# Altium schematic sheet SAML21_Xplained_Pro_TopLevel.SchDoc: Top Level Schematics
size A3; Organization: ATMEL Norway; Address1: Vestre Rosten 79; Address2: N-7075 TILLER; Address3: NORWAY; DocumentNumber: A09-2241; Revision: 4; SheetNumber: 1; SheetTotal: 10; PageSetup: Record=PageOptions|CenterHorizontal=True|CenterVertical=True|PrintScale=1.01|XCorrection=1.00|YCorrection=1.00|PrintKind=1|BorderSize=5000000|LeftOffset=0|BottomOffset=0|Orientation=2|PaperLength=1000|PaperWidth=1000|Scale=100|PaperSource=7|PrintQuality=-4|MediaType=1|DitherType=10|PaperKind=Letter|PrintScaleMode=1
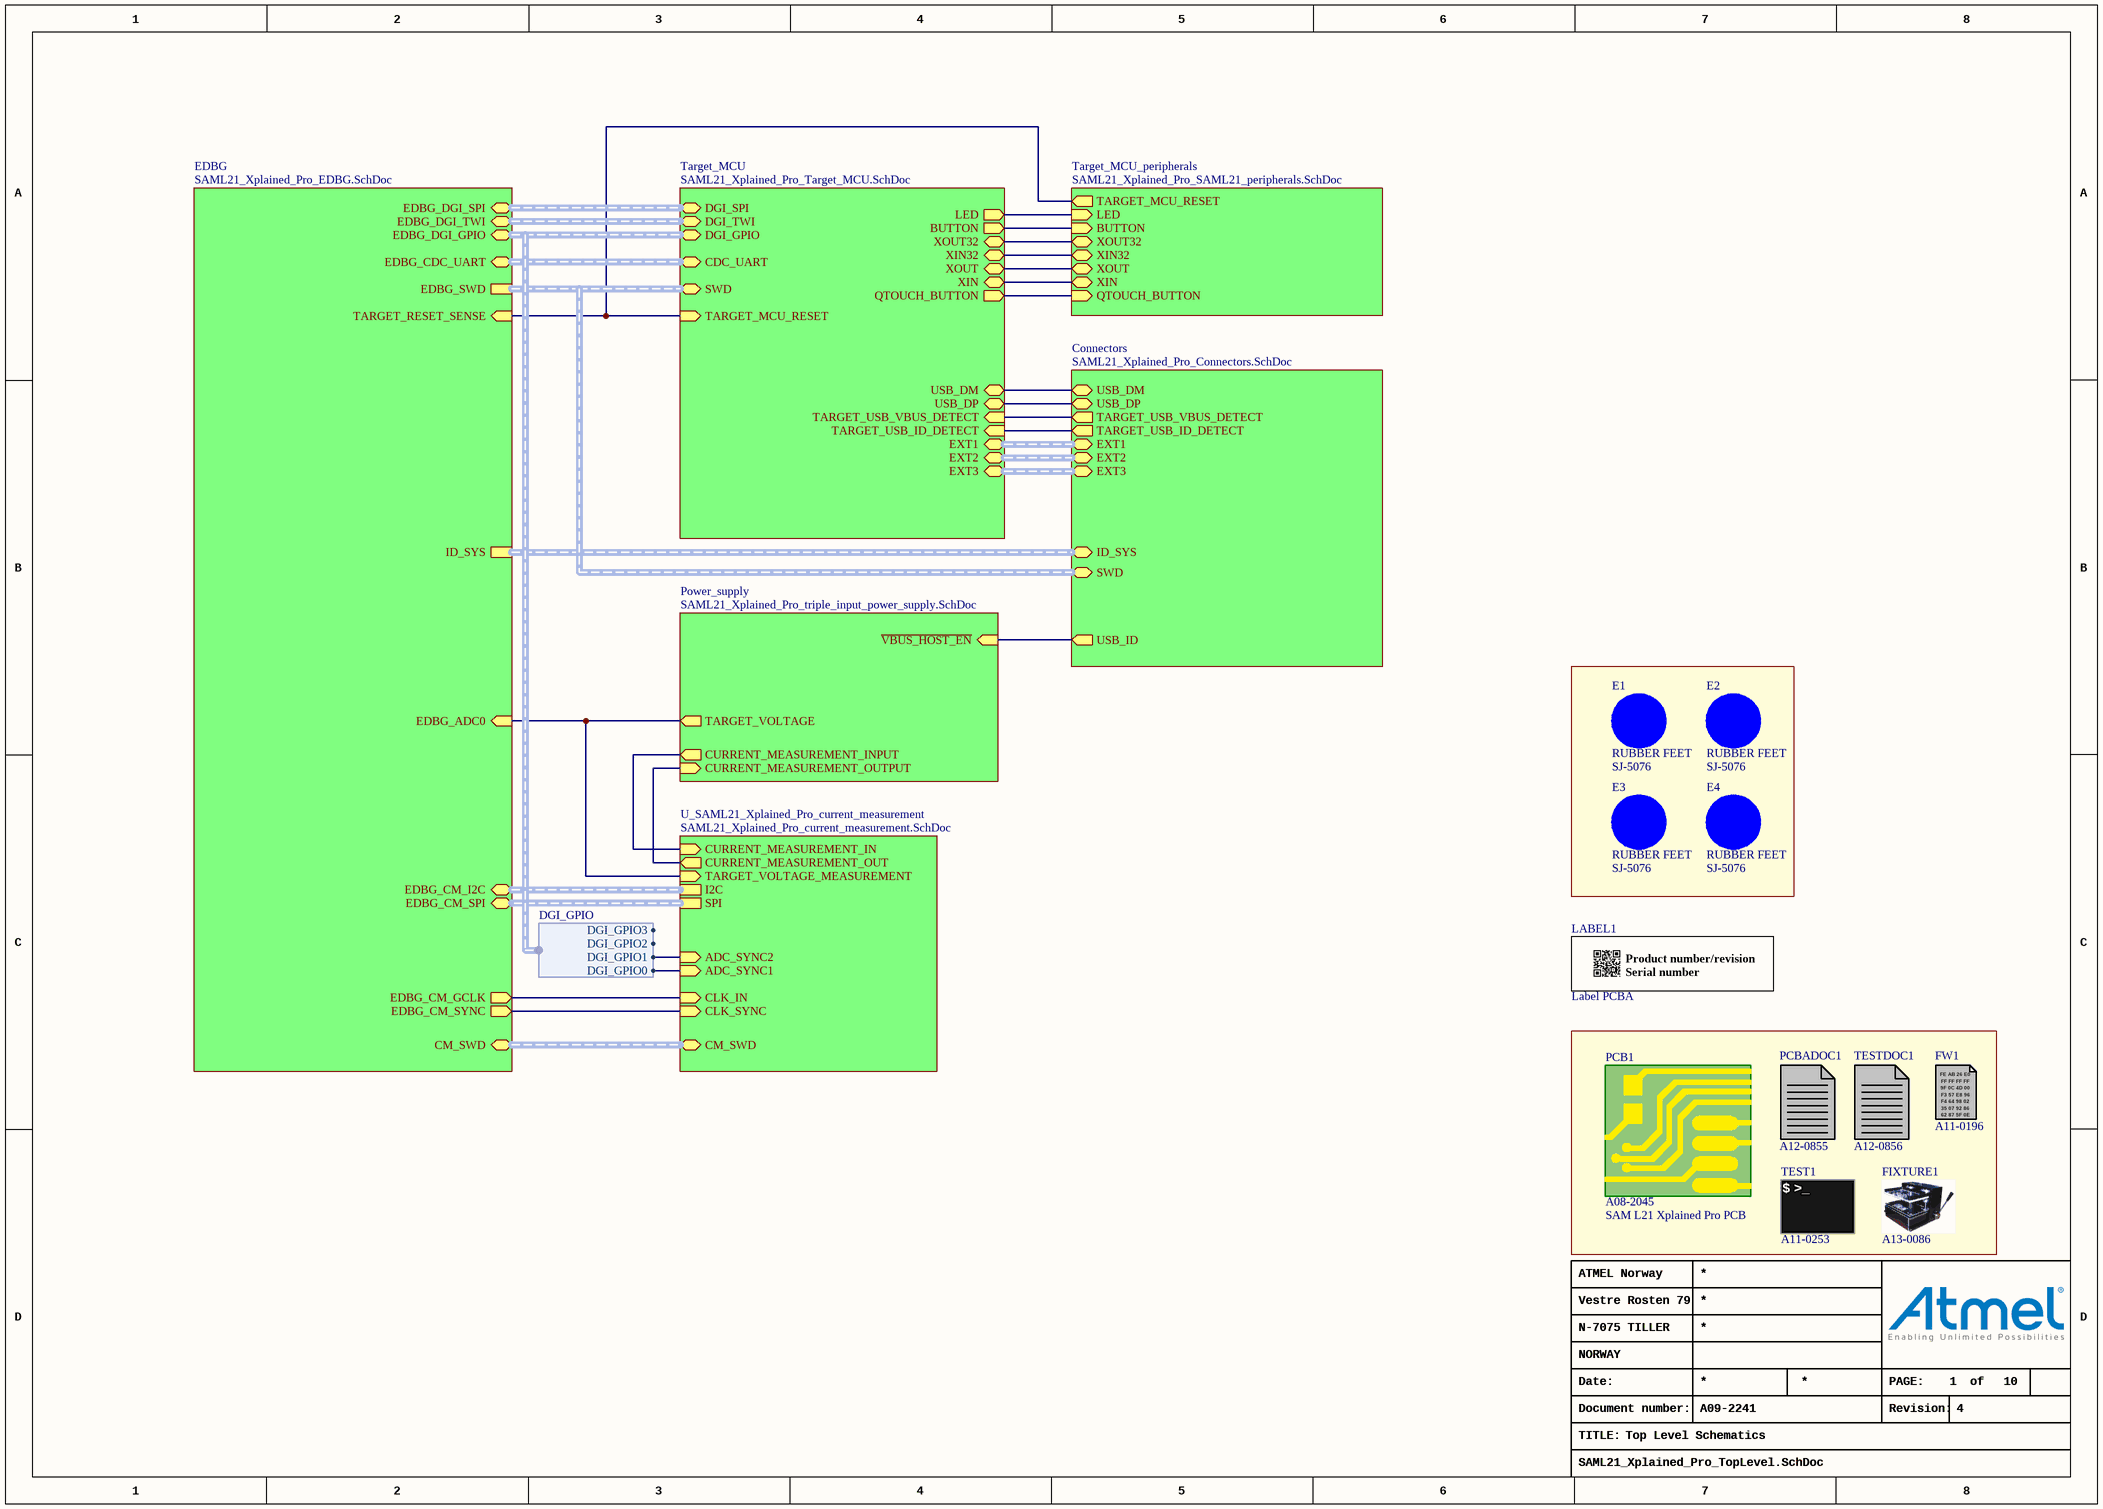
[diagram p0: SAML21_Xplained_Pro_TopLevel.SchDoc]

## Parts
E1  RUBBER FEET  value SJ-5076  [AP8-00192]
E2  RUBBER FEET  value SJ-5076  [AP8-00192]
E3  RUBBER FEET  value SJ-5076  [AP8-00192]
E4  RUBBER FEET  value SJ-5076  [AP8-00192]
FIXTURE1  AN: A13-0086  (hidden comment: JIG)  (mechanical)
FW1  AN: A11-0196  (hidden comment: FW)  (mechanical)
LABEL1  value Label PCBA  [AP8-00317]  (hidden comment: PCBA_LABEL)
PCB1  value SAM L21 Xplained Pro PCB  AN: A08-2045  (hidden comment: PCB)  (mechanical)
PCBADOC1  AN: A12-0855  (hidden comment: PCBADOC)  (mechanical)
TEST1  AN: A11-0253  (hidden comment: TEST)  (mechanical)
TESTDOC1  AN: A12-0856  (hidden comment: TESTDOC)  (mechanical)

## Sub-sheets
Connectors = SAML21_Xplained_Pro_Connectors.SchDoc: ID_SYS (harness ID_SYS), EXT1 (harness EXT), EXT3 (harness EXT), EXT2 (harness EXT), USB_ID (out), USB_DM (bidir), USB_DP (bidir), TARGET_USB_VBUS_DETECT (out), TARGET_USB_ID_DETECT (out), SWD (harness SWD)
EDBG = SAML21_Xplained_Pro_EDBG.SchDoc: ID_SYS (harness ID_SYS), EDBG_SWD (harness SWD), EDBG_CDC_UART (harness CDC_UART), EDBG_DGI_TWI (harness DGI_TWI), EDBG_DGI_SPI (harness DGI_SPI), EDBG_DGI_GPIO (harness DGI_GPIO), TARGET_RESET_SENSE (in), EDBG_ADC0 (in), EDBG_CM_I2C (harness I2C), EDBG_CM_SPI (harness SPI), EDBG_CM_GCLK (out), EDBG_CM_SYNC (out), CM_SWD (harness SWD)
Power_supply = SAML21_Xplained_Pro_triple_input_power_supply.SchDoc: TARGET_VOLTAGE (out), ~{VBUS_HOST_EN} (in), CURRENT_MEASUREMENT_INPUT (out), CURRENT_MEASUREMENT_OUTPUT (in)
Target_MCU = SAML21_Xplained_Pro_Target_MCU.SchDoc: SWD (harness SWD), DGI_SPI (harness DGI_SPI), DGI_TWI (harness DGI_TWI), DGI_GPIO (harness DGI_GPIO), CDC_UART (harness CDC_UART), TARGET_MCU_RESET (in), EXT2 (harness EXT), EXT3 (harness EXT), EXT1 (harness EXT), USB_DM (bidir), USB_DP (bidir), BUTTON (out), LED (out), TARGET_USB_VBUS_DETECT (in), TARGET_USB_ID_DETECT (in), XIN32 (bidir), XOUT32 (bidir), QTOUCH_BUTTON (out), XIN (bidir), XOUT (bidir)
Target_MCU_peripherals = SAML21_Xplained_Pro_SAML21_peripherals.SchDoc: XIN32 (bidir), XOUT32 (bidir), LED (in), QTOUCH_BUTTON (in), BUTTON (in), TARGET_MCU_RESET (out), XIN (bidir), XOUT (bidir)
U_SAML21_Xplained_Pro_current_measurement = SAML21_Xplained_Pro_current_measurement.SchDoc: I2C (harness I2C), SPI (harness SPI), ADC_SYNC1 (in), ADC_SYNC2 (in), CLK_IN (in), CLK_SYNC (in), CURRENT_MEASUREMENT_OUT (out), CURRENT_MEASUREMENT_IN (in), TARGET_VOLTAGE_MEASUREMENT (in), CM_SWD (harness SWD)

## Harnesses
DGI_GPIO: DGI_GPIO0, DGI_GPIO1, DGI_GPIO2, DGI_GPIO3

## Nets
(unnamed): sheet Target_MCU/TARGET_MCU_RESET, sheet EDBG/TARGET_RESET_SENSE, sheet Target_MCU_peripherals/TARGET_MCU_RESET
(unnamed): sheet Target_MCU/USB_DM, sheet Connectors/USB_DM
(unnamed): sheet Target_MCU/USB_DP, sheet Connectors/USB_DP
(unnamed): sheet Target_MCU/BUTTON, sheet Target_MCU_peripherals/BUTTON
(unnamed): sheet Target_MCU/LED, sheet Target_MCU_peripherals/LED
(unnamed): sheet Target_MCU/TARGET_USB_VBUS_DETECT, sheet Connectors/TARGET_USB_VBUS_DETECT
(unnamed): sheet Target_MCU/TARGET_USB_ID_DETECT, sheet Connectors/TARGET_USB_ID_DETECT
(unnamed): sheet Target_MCU/XIN32, sheet Target_MCU_peripherals/XIN32
(unnamed): sheet Target_MCU/XOUT32, sheet Target_MCU_peripherals/XOUT32
(unnamed): sheet Target_MCU/QTOUCH_BUTTON, sheet Target_MCU_peripherals/QTOUCH_BUTTON
(unnamed): sheet Target_MCU/XIN, sheet Target_MCU_peripherals/XIN
(unnamed): sheet Target_MCU/XOUT, sheet Target_MCU_peripherals/XOUT
(unnamed): sheet EDBG/EDBG_ADC0, sheet Power_supply/TARGET_VOLTAGE, sheet U_SAML21_Xplained_Pro_current_measurement/TARGET_VOLTAGE_MEASUREMENT
(unnamed): sheet EDBG/EDBG_CM_GCLK, sheet U_SAML21_Xplained_Pro_current_measurement/CLK_IN
(unnamed): sheet EDBG/EDBG_CM_SYNC, sheet U_SAML21_Xplained_Pro_current_measurement/CLK_SYNC
(unnamed): sheet Connectors/USB_ID, sheet Power_supply/~{VBUS_HOST_EN}
(unnamed): sheet Power_supply/CURRENT_MEASUREMENT_INPUT, sheet U_SAML21_Xplained_Pro_current_measurement/CURRENT_MEASUREMENT_IN
(unnamed): sheet Power_supply/CURRENT_MEASUREMENT_OUTPUT, sheet U_SAML21_Xplained_Pro_current_measurement/CURRENT_MEASUREMENT_OUT
(unnamed): sheet U_SAML21_Xplained_Pro_current_measurement/ADC_SYNC1, sheet Target_MCU/DGI_GPIO.DGI_GPIO0
(unnamed): sheet U_SAML21_Xplained_Pro_current_measurement/ADC_SYNC2, sheet Target_MCU/DGI_GPIO.DGI_GPIO1

Not connected (* = marked no-connect by the designer): E1 1(FIDUCIAL); E2 1(FIDUCIAL); E3 1(FIDUCIAL); E4 1(FIDUCIAL)

## Buses and harness runs
harness sheet Connectors/EXT1 = sheet Target_MCU/EXT1
harness sheet Connectors/EXT2 = sheet Target_MCU/EXT2
harness sheet Connectors/EXT3 = sheet Target_MCU/EXT3
harness sheet Connectors/ID_SYS = sheet EDBG/ID_SYS
harness sheet Connectors/SWD = sheet EDBG/EDBG_SWD = sheet Target_MCU/SWD
harness sheet EDBG/CM_SWD = sheet U_SAML21_Xplained_Pro_current_measurement/CM_SWD
harness sheet EDBG/EDBG_CDC_UART = sheet Target_MCU/CDC_UART
harness sheet EDBG/EDBG_CM_I2C = sheet U_SAML21_Xplained_Pro_current_measurement/I2C
harness sheet EDBG/EDBG_CM_SPI = sheet U_SAML21_Xplained_Pro_current_measurement/SPI
harness sheet EDBG/EDBG_DGI_GPIO = sheet Target_MCU/DGI_GPIO
harness sheet EDBG/EDBG_DGI_SPI = sheet Target_MCU/DGI_SPI
harness sheet EDBG/EDBG_DGI_TWI = sheet Target_MCU/DGI_TWI

## Notes on the sheet
- Date:
- PAGE:
- of
- TITLE:
- Document number:
- Revision:
- (in symbol A09-0611) / Product number/revision / Serial number
- (in symbol A11-0196) FE AB 26 E0; FF FF FF FF; 9F 0C 4D 00; F3 57 E8 96; F4 64 98 02; 35 07 92 86; 62 87 5F 0E
- (in symbol A11-0253) $ >_

## Library data of the parts
E1-E4 = A08-0053: 2.8mm adhesive feet,diam 8.0mm; PartGroup: Mechanical devices,Mounting accessories; Manufacturer: 3M; AN: A08-0053; Height: 2,79999995231628; MPN: SJ-5076
FIXTURE1 = A13-0086: Xplained PRO MCU board Jupiter Test Fixture; PartGroup: Test Equipment,Test Fixtures; Manufacturer: ESCATEC; Value: Xplained PRO MCU board Jupiter Test Fixture; MPN: Xplained PRO MCU board Jupiter Test Fixture
FW1 = A11-0196: EDBG secured firmware; PartGroup: Software,Firmware,Tools; Manufacturer: ATMEL; Value: EDBG secured firmware
LABEL1 = A09-0611: PCBA identification label PP Top White Gloss; PartGroup: Mechanical devices,Packaging materials,Printed Labels; Manufacturer: ACT Logimark AS; MPN: 505462; AN: A09-0611
PCB1 = A08-2045: SAM L21 Xplained Pro PCB, 4 layer, 60mm x 100mm; PartGroup: Mechanical devices,Printed circuit boards
PCBADOC1 = A12-0855: SAM L21 Xplained Pro PCBA documentation; PartGroup: Documentation,PCBA Documents,Atmel; Value: A09-2241 PCBA Files
TEST1 = A11-0253: Fixture eggTest for SAM L21 Xplained Pro; PartGroup: Software,Test software,Starter Kit; Value: SAM L21 Xplained Pro Test
TESTDOC1 = A12-0856: SAM L21 Xplained Pro Test Instructions; PartGroup: Documentation,Procedures,Test Instructions; Value: SAM L21 Xplained Pro Test Instructions